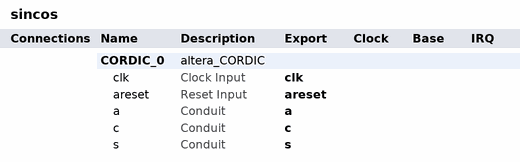
[diagram p0: system contents]
# Platform Designer (Qsys) system sincos, Cyclone V 5CSEMA5F31C6
# Parameters at their usual value, and those the tool derives, are not listed.
package require -exact qsys 22.1
create_system sincos
set_project_property DEVICE_FAMILY {Cyclone V}
set_project_property DEVICE 5CSEMA5F31C6

add_instance CORDIC_0 altera_CORDIC 22.1
set_instance_property CORDIC_0 AUTO_EXPORT true
set_instance_parameter_value CORDIC_0 ALL_function SINCOS
set_instance_parameter_value CORDIC_0 FUNCTION_FAMILY ALL
set_instance_parameter_value CORDIC_0 LUTSize 6
set_instance_parameter_value CORDIC_0 SFCompensation false
set_instance_parameter_value CORDIC_0 frequency_target 50
set_instance_parameter_value CORDIC_0 fxpt_in_fraction 7
set_instance_parameter_value CORDIC_0 fxpt_in_sign 1
set_instance_parameter_value CORDIC_0 fxpt_in_width 32
set_instance_parameter_value CORDIC_0 fxpt_out_fraction 1
set_instance_parameter_value CORDIC_0 fxpt_out_width 32
set_instance_parameter_value CORDIC_0 gen_enable false
set_instance_parameter_value CORDIC_0 latency_target 2
set_instance_parameter_value CORDIC_0 performance_goal frequency
set_instance_parameter_value CORDIC_0 report_resources_to_xml false
set_instance_parameter_value CORDIC_0 selected_device_family {Cyclone V}
set_instance_parameter_value CORDIC_0 selected_device_speedgrade 6
set_instance_parameter_value CORDIC_0 specifyLUTs false
set_instance_parameter_value CORDIC_0 useLUTs false

# exported interfaces
add_interface a conduit end
set_interface_property a EXPORT_OF CORDIC_0.a
add_interface areset reset sink
set_interface_property areset EXPORT_OF CORDIC_0.areset
add_interface c conduit end
set_interface_property c EXPORT_OF CORDIC_0.c
add_interface clk clock sink
set_interface_property clk EXPORT_OF CORDIC_0.clk
add_interface s conduit end
set_interface_property s EXPORT_OF CORDIC_0.s

set_interconnect_requirement {$system} qsys_mm.clockCrossingAdapter HANDSHAKE
set_interconnect_requirement {$system} qsys_mm.enableEccProtection FALSE
set_interconnect_requirement {$system} qsys_mm.insertDefaultSlave FALSE
set_interconnect_requirement {$system} qsys_mm.maxAdditionalLatency 1

save_system sincos.qsys
